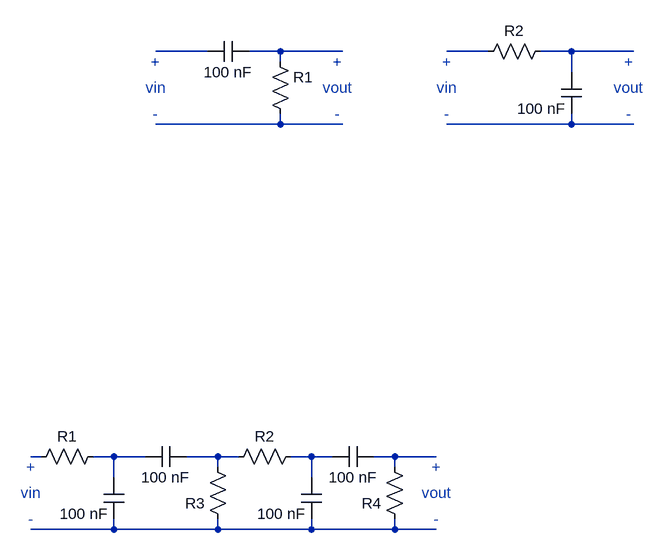
[diagram p0: schematic pre5.asc]
pre5.asc, the LTspice schematic file:
Version 4.1
SHEET 1 932 856
WIRE 256 112 176 112
WIRE 368 112 320 112
WIRE 464 112 368 112
WIRE 688 112 624 112
WIRE 816 112 768 112
WIRE 912 112 816 112
WIRE 368 128 368 112
WIRE 816 144 816 112
WIRE 368 224 368 208
WIRE 368 224 176 224
WIRE 464 224 368 224
WIRE 816 224 816 208
WIRE 816 224 624 224
WIRE 912 224 816 224
WIRE 0 736 -16 736
WIRE 112 736 80 736
WIRE 160 736 112 736
WIRE 272 736 224 736
WIRE 304 736 272 736
WIRE 416 736 384 736
WIRE 448 736 416 736
WIRE 544 736 512 736
WIRE 608 736 544 736
WIRE 272 752 272 736
WIRE 544 752 544 736
WIRE 112 768 112 736
WIRE 416 768 416 736
WIRE 112 848 112 832
WIRE 112 848 -16 848
WIRE 272 848 272 832
WIRE 272 848 112 848
WIRE 416 848 416 832
WIRE 416 848 272 848
WIRE 544 848 544 832
WIRE 544 848 416 848
WIRE 608 848 544 848
SYMBOL cap 320 96 R90
WINDOW 0 0 32 Invisible 2
WINDOW 3 32 32 VTop 2
SYMATTR InstName 100nF
SYMATTR Value 100 nF
SYMBOL res 352 112 R0
WINDOW 0 51 40 Center 2
SYMATTR InstName R1
SYMATTR Value ""
SYMBOL cap 832 208 R180
WINDOW 0 24 56 Invisible 2
WINDOW 3 24 8 Left 2
SYMATTR InstName C1
SYMATTR Value 100 nF
SYMBOL res 784 96 R90
WINDOW 0 0 56 VBottom 2
WINDOW 3 32 56 VTop 2
SYMATTR InstName R2
SYMATTR Value ""
SYMBOL cap 128 832 R180
WINDOW 0 24 56 Invisible 2
WINDOW 3 24 8 Left 2
SYMATTR InstName C2
SYMATTR Value 100 nF
SYMBOL res 96 720 R90
WINDOW 0 0 56 VBottom 2
WINDOW 3 32 56 VTop 2
SYMATTR InstName R1
SYMATTR Value ""
SYMBOL cap 160 752 R270
WINDOW 0 32 32 Invisible 2
WINDOW 3 0 32 VBottom 2
SYMATTR InstName C3
SYMATTR Value 100 nF
SYMBOL res 288 848 R180
WINDOW 3 36 19 Left 2
SYMATTR InstName R3
SYMATTR Value ""
SYMBOL res 288 752 R270
WINDOW 0 32 56 VTop 2
WINDOW 3 0 56 VBottom 2
SYMATTR InstName R2
SYMATTR Value ""
SYMBOL cap 432 832 R180
WINDOW 0 24 56 Invisible 2
WINDOW 3 24 8 Left 2
SYMATTR InstName C4
SYMATTR Value 100 nF
SYMBOL res 560 848 R180
WINDOW 0 36 76 Invisible 2
WINDOW 3 36 40 Left 2
SYMATTR InstName R4
SYMATTR Value R4
SYMBOL cap 448 752 R270
WINDOW 0 32 32 Invisible 2
WINDOW 3 0 32 VBottom 2
SYMATTR InstName C5
SYMATTR Value 100 nF
TEXT 176 128 Center 2 ;+
TEXT 176 168 Center 2 ;vin
TEXT 176 208 Center 2 ;-
TEXT 456 128 Center 2 ;+
TEXT 456 168 Center 2 ;vout
TEXT 456 208 Center 2 ;-
TEXT 624 128 Center 2 ;+
TEXT 624 168 Center 2 ;vin
TEXT 624 208 Center 2 ;-
TEXT 904 128 Center 2 ;+
TEXT 904 168 Center 2 ;vout
TEXT 904 208 Center 2 ;-
TEXT -16 752 Center 2 ;+
TEXT -16 792 Center 2 ;vin
TEXT -16 832 Center 2 ;-
TEXT 608 752 Center 2 ;+
TEXT 608 792 Center 2 ;vout
TEXT 608 832 Center 2 ;-

The netlist it stands for:
* pre5.asc
C§100nF N002 N001 100 nF
R1 N002 N005
C1 N006 N004 100 nF
R2 N004 N003
C2 N012 N008 100 nF
R1 N008 N007
C3 N008 N009 100 nF
R3 N012 N009
R2 N009 N010
C4 N012 N010 100 nF
R4 N012 N011 R4
C5 N010 N011 100 nF
* +
* vin
* -
* +
* vout
* -
* +
* vin
* -
* +
* vout
* -
* +
* vin
* -
* +
* vout
* -
.backanno
.end